# EAGLE schematic untitled (EAGLE 8.0.1)
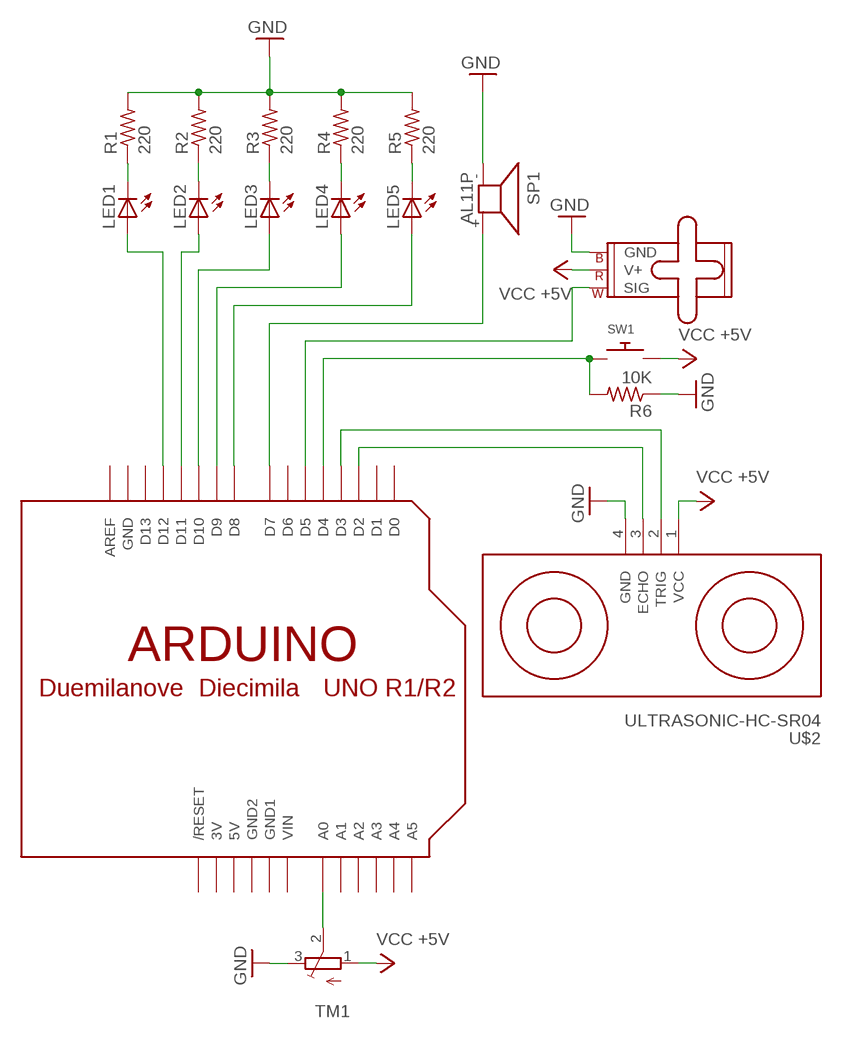
[diagram p0: schematic, sheet 1]

## Parts
LED1  LED3MM  [LED3MM]
LED2  LED3MM  [LED3MM]
LED3  LED3MM  [LED3MM]
LED4  LED3MM  [LED3MM]
LED5  LED3MM  [LED3MM]
M1  SMALL_SERVO  [1X03]
R1  220  R-US_0204/5  [0204/5]
R2  220  R-US_0204/5  [0204/5]
R3  220  R-US_0204/5  [0204/5]
R4  220  R-US_0204/5  [0204/5]
R5  220  R-US_0204/5  [0204/5]
R6  10K  R-US_0204/5  [0204/5]
SP1  AL11P  [AL11P]
SW1  SWITCH_PUSHBUTTONEVQ-PE  [TACT_PANA-EVQ]
TM1  TRIMPOT3386  [TRIM-3386]
U$1  ARDUINOUNO  [ARDUINO]
U$2  ULTRASONIC-HC-SR04  [ULTRASONIC-HC-SR04]

## Nets
GND: M1.3(GND) R1.2 R2.2 R3.2 R4.2 R5.2 R6.1 SP1.- TM1.3(E) U$2.4(GND)
N$1: LED1.A U$1.D12
N$2: LED2.A U$1.D11
N$3: LED3.A U$1.D10
N$4: LED4.A U$1.D9
N$5: LED5.A U$1.D8
N$6: LED1.K(C) R1.1
N$7: LED4.K(C) R4.1
N$8: LED5.K(C) R5.1
N$9: LED2.K(C) R2.1
N$10: LED3.K(C) R3.1
N$11: TM1.2(S) U$1.A0
N$12: SP1.+ U$1.D7
N$13: M1.1(SIG) U$1.D5
N$14: R6.2 SW1.P$1 U$1.D4
N$15: U$1.D2 U$2.3(ECHO)
N$16: U$1.D3 U$2.2(TRIG)
VCC: M1.2(V+) SW1.P$2 TM1.1(A) U$2.1(VCC) ; supply symbol labelled VCC +5V
Unconnected: U$1.A1 U$1.A2 U$1.A3 U$1.A4 U$1.A5 U$1.AREF U$1.D0 U$1.D1 U$1.D6 U$1.D13 U$1.RESET(/RESET)

## Power pins joined to a net without a drawn wire
3V: U$1.3V
5V: U$1.5V
GND: U$1.GND
GND1: U$1.GND1
GND2: U$1.GND2
VIN: U$1.VIN

## Library data of the parts
LED1-LED5 = adafruit:LED: LED OSRAM: - CHIPLED LG R971, LG N971, LY N971, LG Q971, LY Q971, LO R971, LY R971 LH N974, LH R974 LS Q976, LO Q976, LY Q976 LO Q996 - Hyper CHIPLED LW Q18S LB Q993, LB Q99A, LB R99A - SideLED LS A670, LO A670, LY A670, LG A670, LP A670 LB A673, LV A673, LT A673, LW A673 LH A674 LY A675 LS A676, LA A676, LO A676, LY A676, LW A676 LS A679, LY A679, LG A679 - Hyper Micro SIDELED® LS Y876, LA Y876, LO Y876, LY Y876 LT Y87S - SmartLED LW L88C, LW L88S LB L89C, LB L89S, LG L890 LS L89K, LO L89K, LY L89K LS L896, LA L896, LO L896, LY L896 - TOPLED LS T670, LO T670, LY T670, LG T670, LP T670 LSG T670, LSP T670, LSY T670, LOP T670, LYG T670 LG T671, LOG T671, LSG T671 LB T673, LV T673, LT T673, LW T673 LH T674 LS T676, LA T676, LO T676, LY T676, LB T676, LH T676, LSB T676, LW T676 LB T67C, LV T67C, LT T67C, LS T67K, LO T67K, LY T67K, LW E67C LS E67B, LA E67B, LO E67B, LY E67B, LB E67C, LV E67C, LT E67C LW T67C LS T679, LY T679, LG T679 LS T770, LO T770, LY T770, LG T770, LP T770 LB T773, LV T773, LT T773, LW T773 LH T774 LS E675, LA E675, LY E675, LS T675 LS T776, LA T776, LO T776, LY T776, LB T776 LHGB T686 LT T68C, LB T68C - Hyper Mini TOPLED® LB M676 - Mini TOPLED Santana® LG M470 LS M47K, LO M47K, LY M47K Source: http://www.osram.convergy.de/
M1 = SparkFun-Electromechanical:SMALL_SERVO: Small servo motor This is the small servo used in the SIK. SKU: ROB-09065
R1-R6 = adafruit:R-US_: RESISTOR, American symbol
SP1 = buzzer:AL11P: SPEAKER Source: Buerklin; OC_FARNELL: unknown; OC_NEWARK: unknown
SW1 = adafruit:SWITCH_PUSHBUTTON: Buttons SOFTTOUCHSMD_SJ - Soft touch temporary push button (Super Junk Akihabara) Compatible with SKPMANE010 [Mouser: 688-SKPMAN] C&K_KSS = Digikey: KSS221GLFS
TM1 = adafruit:TRIMPOT: SMT trimmer potentiometer part number TC33X http://www.ladyada.net/library/eagle
U$1 = adafruit:ARDUINO: Arduino Diecimila/Duemilanove Make a shield with ease, this package has all the named pins as well as the two mounting drill holes and an outline of the USB and DC power connector. The outline is on the DIMENSION layer, so if your board house uses it they will cut the outline to match. http://www.ladyada.net/library/pcb/eaglelibrary.html
U$2 = diy-modules:ULTRASONIC-HC-SR04: Ultrasonic Ranging Module HC-SR04 More details available here: http://randomnerdtutorials.com/complete-guide-for-ultrasonic-sensor-hc-sr04/ Click here to find device on ebay.com <http://www.ebay.com/sch/hc+sr04+ultrasonic>